# Altium schematic sheet DW1000.SchDoc
size A; SheetNumber: 4; SheetTotal: 5
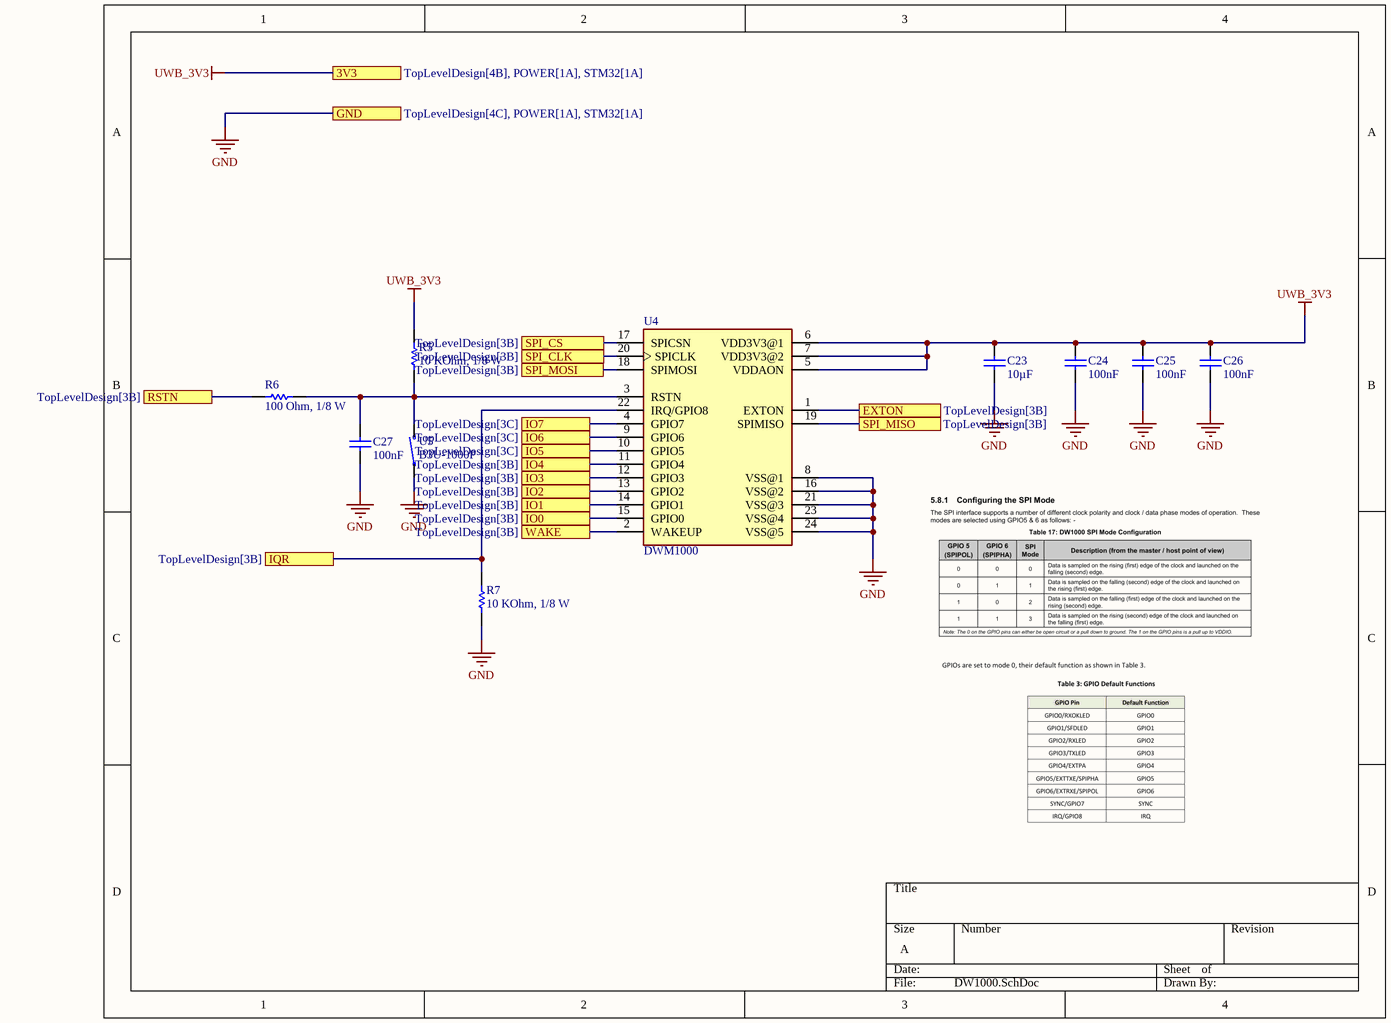
[diagram p0: DW1000.SchDoc]

## Parts
C23  value 10µF  [CAP_0805]  (hidden comment: 0108051061025)
C24  value 100nF  [CAP_0603]  (hidden comment: 0106031041050)
C25  value 100nF  [CAP_0603]  (hidden comment: 0106031041050)
C26  value 100nF  [CAP_0603]  (hidden comment: 0106031041050)
C27  value 100nF  [CAP_0603]  (hidden comment: 0106031041050)
R5  value 10 KOhm, 1/8 W  [RESISTOR_0805]  (hidden comment: 0008051035)
R6  value 100 Ohm, 1/8 W  [RESISTOR_0805]  (hidden comment: 0008051011)
R7  value 10 KOhm, 1/8 W  [RESISTOR_0805]  (hidden comment: 0008051035)
U4  DWM1000  [XCVR_DWM1000]
U5  B3U-1000P  [SODFL4025X160N]

## Ports
3V3 (see TopLevelDesign[4B], POWER[1A], STM32[1A]), EXTON (see TopLevelDesign[3B]), GND (see TopLevelDesign[4C], POWER[1A], STM32[1A]), IO0 (see TopLevelDesign[3B]), IO1 (see TopLevelDesign[3B]), IO2 (see TopLevelDesign[3B]), IO3 (see TopLevelDesign[3B]), IO4 (see TopLevelDesign[3B]), IO5 (see TopLevelDesign[3C]), IO6 (see TopLevelDesign[3C]), IO7 (see TopLevelDesign[3C]), IQR (see TopLevelDesign[3B]), RSTN (see TopLevelDesign[3B]), SPI_CLK (see TopLevelDesign[3B]), SPI_CS (see TopLevelDesign[3B]), SPI_MISO (see TopLevelDesign[3B]), SPI_MOSI (see TopLevelDesign[3B]), WAKE (see TopLevelDesign[3B])

## Nets
GND: C23.1 C24.1 C25.1 C26.1 C27.1 R7.1 U4.8(VSS@1) U4.16(VSS@2) U4.21(VSS@3) U4.23(VSS@4) U4.24(VSS@5) U5.1 ; port GND
UWB_3V3: C23.2 C24.2 C25.2 C26.2 R5.2 U4.5(VDDAON) U4.6(VDD3V3@1) U4.7(VDD3V3@2) ; port 3V3
EXTON: U4.1(EXTON) ; port EXTON
IO0: U4.15(GPIO0) ; port IO0
IO1: U4.14(GPIO1) ; port IO1
IO2: U4.13(GPIO2) ; port IO2
IO3: U4.12(GPIO3) ; port IO3
IO4: U4.11(GPIO4) ; port IO4
IO5: U4.10(GPIO5) ; port IO5
IO6: U4.9(GPIO6) ; port IO6
IO7: U4.4(GPIO7) ; port IO7
IQR: R7.2 U4.22(IRQ/GPIO8) ; port IQR
RSTN: R6.1 ; port RSTN
SPI_CLK: U4.20(SPICLK) ; port SPI_CLK
SPI_CS: U4.17(SPICSN) ; port SPI_CS
SPI_MISO: U4.19(SPIMISO) ; port SPI_MISO
SPI_MOSI: U4.18(SPIMOSI) ; port SPI_MOSI
WAKE: U4.2(WAKEUP) ; port WAKE
NetC27_2: C27.2 R5.1 R6.2 U4.3(RSTN) U5.2

## Library data of the parts
C23 = CMP-001-00265-1: CAP, size 0805, 10 uF, 25 VDC; Manufacture SN: CGA4J1X7S1E106K125AE; Manufacture Name: TDK; Voltage Rating DC: 25 VDC; Tolerance: 10%; Source: Capacitor_0805_10_percent.SchLib; Mounting Technology: SMT; Supplier 3 SN: OEM; Size: 0805; Design Item ID: 0108051061025; Supplier 2 SN: 445-181411-2-ND; Supplier 1 URL: https://www.mouser.vn/ProductDetail/TDK/CGA4J1X7S1E106K125AE?qs=PqoDHHvF64%252BJvhmUzM2odA%3D%3D&utm_source=mouser-refine-download&utm_medium=file&utm_campaign=CGA4J1X7S1E106K125AE&utm_content=TDK; Supplier 3 Name: thegioiic; Pins: 2; Packaging: Tape and Reel; Supplier 2 Name: Digi-Key; Operating Temperature: -55 to +125degC; Supplier 1 SN: 810-CGA4J1X7S1E106K2; Component Type: Standard; Supplier 3 URL: N/A; Supplier 1 Name: Mouser; Supplier 2 URL: https://www.digikey.com/en/products/detail/tdk-corporation/cga4j1x7s1e106k125ae/9744777
C24-C27 = CMP-001-00214-1: CAP, size 0603, 100 nF, 50 VDC; Manufacture SN: CGA3E3X8R1H104K080AE; Manufacture Name: TDK; Tolerance: 10%; Voltage Rating DC: 50 VDC; Supplier 2 Name: Digi-Key; Pins: 2; Supplier 3 Name: thegioiic; Design Item ID: 0106031041050; Supplier 1 Name: Mouser; Supplier 1 URL: https://www.mouser.com/ProductDetail/TDK/CGA3E3X8R1H104K080AE?qs=nQSIdc08i%252Bd8g3IRRgU2bw%3D%3D&utm_source=mouser-refine-download&utm_medium=file&utm_campaign=CGA3E3X8R1H104K080AE&utm_content=TDK; Size: 0603; Supplier 2 URL: https://www.digikey.com/en/products/detail/tdk-corporation/cga3e3x8r1h104k080ae/5809262; Operating Temperature: -55 to +125degC; Packaging: Tape and Reel; Source: Capacitor_0603_10_percent.SchLib; Supplier 1 SN: 810-CGA3E3X8R1H104KA; Supplier 3 SN: N/A; Supplier 2 SN: 445-173697-2-ND; Mounting Technology: SMT; Supplier 3 URL: N/A; Component Type: Standard
R5 R7 = CMP-009-00424-1: RES, size 0805, 10 KOhm, 1/8 W; Manufacture  SN: CRCW080510K0JNEAC; Manufacture  Name: Vishay Dale; Resistance Tolerance: +/-5%; Rated Power: 1/8 W; ComponentLink4URL: N/A; Supplier 3 SN: N/A; Supplier 1 SN: 71-CRCW080510K0JNEB; Source: Resistor_0805.SchLib; Supplier 3 URL: N/A; Supplier 3 Name: Thegioiic; ComponentLink2Description: Supplier 1 URL; ComponentLink4Description: Supplier 3 URL; Supplier 2 URL: https://www.digikey.com/en/products/detail/vishay-dale/CRCW080510K0JNEAC/7928585; ComponentLink3Description: Supplier 2 URL; Size: 0805; ComponentLink1Description: Datasheet link; Supplier 1 URL: https://www.mouser.vn/ProductDetail/Vishay-Dale/CRCW080510K0JNEB?qs=LOX6nxTstiZ5fn9YUdHx5A%3D%3D; Supplier 1 Name: Mouser; Pins: 2; Design Item ID: 0008051035; Supplier 2 SN: 541-4163-2-ND; Supplier 2 Name: Digi-Key; ComponentLink3URL: https://www.digikey.com/en/products/detail/vishay-dale/CRCW080510K0JNEAC/7928585; Component Type: Standard; ComponentLink2URL: https://www.mouser.vn/ProductDetail/Vishay-Dale/CRCW080510K0JNEB?qs=LOX6nxTstiZ5fn9YUdHx5A%3D%3D; Mounting Technology: SMT; ComponentLink1URL: https://www.vishay.com/docs/28773/crcwce3.pdf
R6 = CMP-009-00419-1: RES, size 0805, 100 Ohm, 1/8 W; Manufacture  SN: CRCW0805100RFKEB; Manufacture  Name: Vishay Dale Thin Film; Resistance Tolerance: +/-1%; Rated Power: 1/8 W; ComponentLink2Description: Supplier 1 URL; Size: 0805; Supplier 3 Name: Thegioiic; ComponentLink2URL: https://www.mouser.vn/ProductDetail/Vishay-Dale/CRCW0805100RFKEB?qs=sGAEpiMZZMtlubZbdhIBIKpw3Cj3Rl3MFHVHXIgVmtw%3D; ComponentLink3URL: https://www.digikey.com/en/products/detail/vpg-foil-resistors/Y1624100R000F9R/6026579; Supplier 3 URL: https://www.thegioiic.com/dien-tro-100-ohm-0805-1-; Mounting Technology: SMT; ComponentLink1URL: https://media.digikey.com/pdf/Data%20Sheets/Vishay%20Resistors/VSMP_Series_Z_Series_DS.pdf; ComponentLink1Description: Datasheet link; Supplier 2 Name: Digi-Key; Supplier 2 SN: Y1624100R000F9R-ND; Supplier 2 URL: https://www.digikey.com/en/products/detail/vpg-foil-resistors/Y1624100R000F9R/6026579; Supplier 1 Name: Mouser; Design Item ID: 0008051011; ComponentLink4Description: Supplier 3 URL; ComponentLink3Description: Supplier 2 URL; Supplier 3 SN: N/A; Supplier 1 SN: 71-CRCW0805100RFKEB; Source: Resistor_0805.SchLib; ComponentLink4URL: https://www.thegioiic.com/dien-tro-100-ohm-0805-1-; Pins: 2; Component Type: Standard; Supplier 1 URL: https://www.mouser.vn/ProductDetail/Vishay-Dale/CRCW0805100RFKEB?qs=sGAEpiMZZMtlubZbdhIBIKpw3Cj3Rl3MFHVHXIgVmtw%3D
U4 = CMP-279-000000-4: 802.15.4 IR-UWB Transceiver Module 3.5GHz ~ 6.5GHz Integrated, Chip Surface Mount; MF: Decawave Limited; Price: None; Value: *; Availability: Unavailable; Source: SnapEDAsch.SchLib; SnapEDA_Link: https://www.snapeda.com/parts/DWM1000/Decawave%20Limited/view-part/327593/?ref=snap; Component Type: Standard; Package: Module Decawave; Design Item ID: DWM1000; MP: DWM1000; Pin Count: 24
U5 = CMP-011-00123-3: Switch Tactile N.O. SPST Round Button Gull Wing 0.05A 12VDC 1.5N SMD T/R; MP: B3U1000P; MF: Omron; Design Item ID: B3U-1000P; Value: *; Component Type: Standard; Check_prices: https://www.snapeda.com/parts/B3U1000P/Omron/view-part/?ref=eda; SnapEDA_Link: https://www.snapeda.com/parts/B3U1000P/Omron/view-part/?ref=snap; Pins: 2; Case/Package: None; Source: B3U-1000P.SchLib